# EAGLE design heaters (EAGLE 8.3.0)

## Sheet 1 of 4
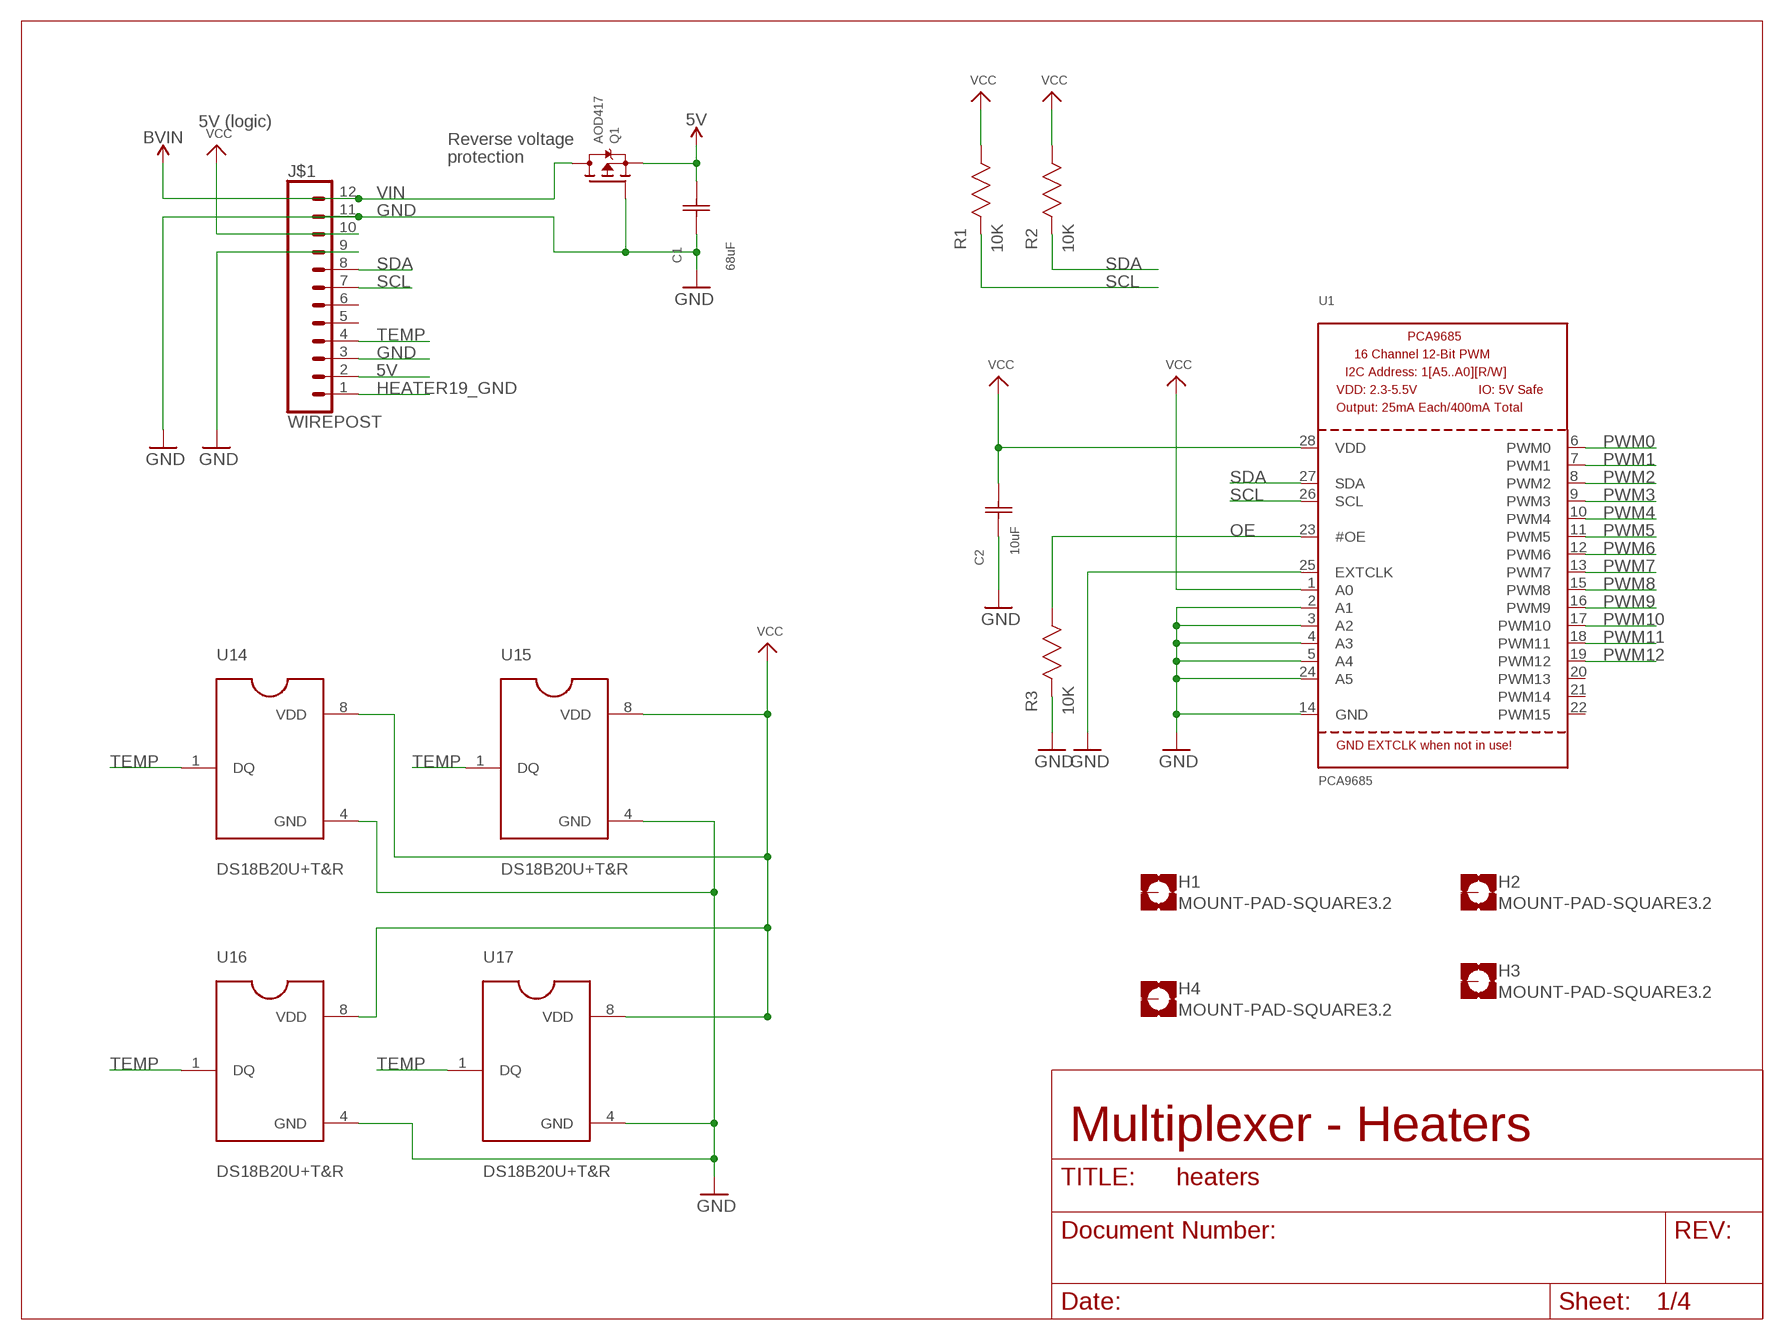
[diagram p0: schematic, sheet 1]

### Parts
C1  68uF  C5750X5R1A686M230KA  [CAP_5750]
C2  10uF  1206YC106KAT2A  [1206]
H1  MOUNT-PAD-SQUARE3.2  [3,2-PAD-SQUARE]
H2  MOUNT-PAD-SQUARE3.2  [3,2-PAD-SQUARE]
H3  MOUNT-PAD-SQUARE3.2  [3,2-PAD-SQUARE]
H4  MOUNT-PAD-SQUARE3.2  [3,2-PAD-SQUARE]
J$1  WIREPOST  [WIREWRAPPOST]
Q1  AOD417  MOSFET-PTO252  [TO252]
R1  10K  RC0603JR-0710KL  [RC0603N]
R2  10K  RC0603JR-0710KL  [RC0603N]
R3  10K  RC0603JR-0710KL  [RC0603N]
U1  PCA9685  [TSSOP28]
U14  DS18B20U+T&R  [SOP65P500X110-8N]
U15  DS18B20U+T&R  [SOP65P500X110-8N]
U16  DS18B20U+T&R  [SOP65P500X110-8N]
U17  DS18B20U+T&R  [SOP65P500X110-8N]

### Nets
5V: C1.2 J$1.2 Q1.2(S) ; also sheet 2,3,4
GND: C1.1 C2.1 J$1.3 J$1.9 J$1.11 Q1.1(G) R3.2 U1.2(A1) U1.3(A2) U1.4(A3) U1.5(A4) U1.14(GND) U1.24(A5) U1.25(EXTCLK) U14.4(GND) U15.4(GND) U16.4(GND) U17.4(GND) ; also sheet 2,3,4
HEATER19_GND: J$1.1
OE: R3.1 U1.23(#OE) ; also sheet 4
PWM0: U1.6(PWM0) ; also sheet 2
PWM1: U1.7(PWM1) ; also sheet 2
PWM2: U1.8(PWM2) ; also sheet 2
PWM3: U1.9(PWM3) ; also sheet 2
PWM4: U1.10(PWM4) ; also sheet 2
PWM5: U1.11(PWM5) ; also sheet 2
PWM6: U1.12(PWM6) ; also sheet 3
PWM7: U1.13(PWM7) ; also sheet 3
PWM8: U1.15(PWM8) ; also sheet 3
PWM9: U1.16(PWM9) ; also sheet 3
PWM10: U1.17(PWM10) ; also sheet 3
PWM11: U1.18(PWM11) ; also sheet 3
PWM12: U1.19(PWM12)
SCL: J$1.7 R1.2 U1.26(SCL) ; also sheet 4
SDA: J$1.8 R2.2 U1.27(SDA) ; also sheet 4
TEMP: J$1.4 U14.1(DQ) U15.1(DQ) U16.1(DQ) U17.1(DQ)
VCC: C2.2 J$1.10 R1.1 R2.1 U1.1(A0) U1.28(VDD) U14.8(VDD) U15.8(VDD) U16.8(VDD) U17.8(VDD) ; also sheet 4
VIN: J$1.12 Q1.3(D)
Unconnected: H1.B3,2(MOUNT) H2.B3,2(MOUNT) H3.B3,2(MOUNT) H4.B3,2(MOUNT) J$1.5 J$1.6 U1.20(PWM13) U1.21(PWM14) U1.22(PWM15)

### Notes on the sheet
- 5V (logic)
- Reverse voltage
- protection
- Multiplexer - Heaters

## Sheet 2 of 4
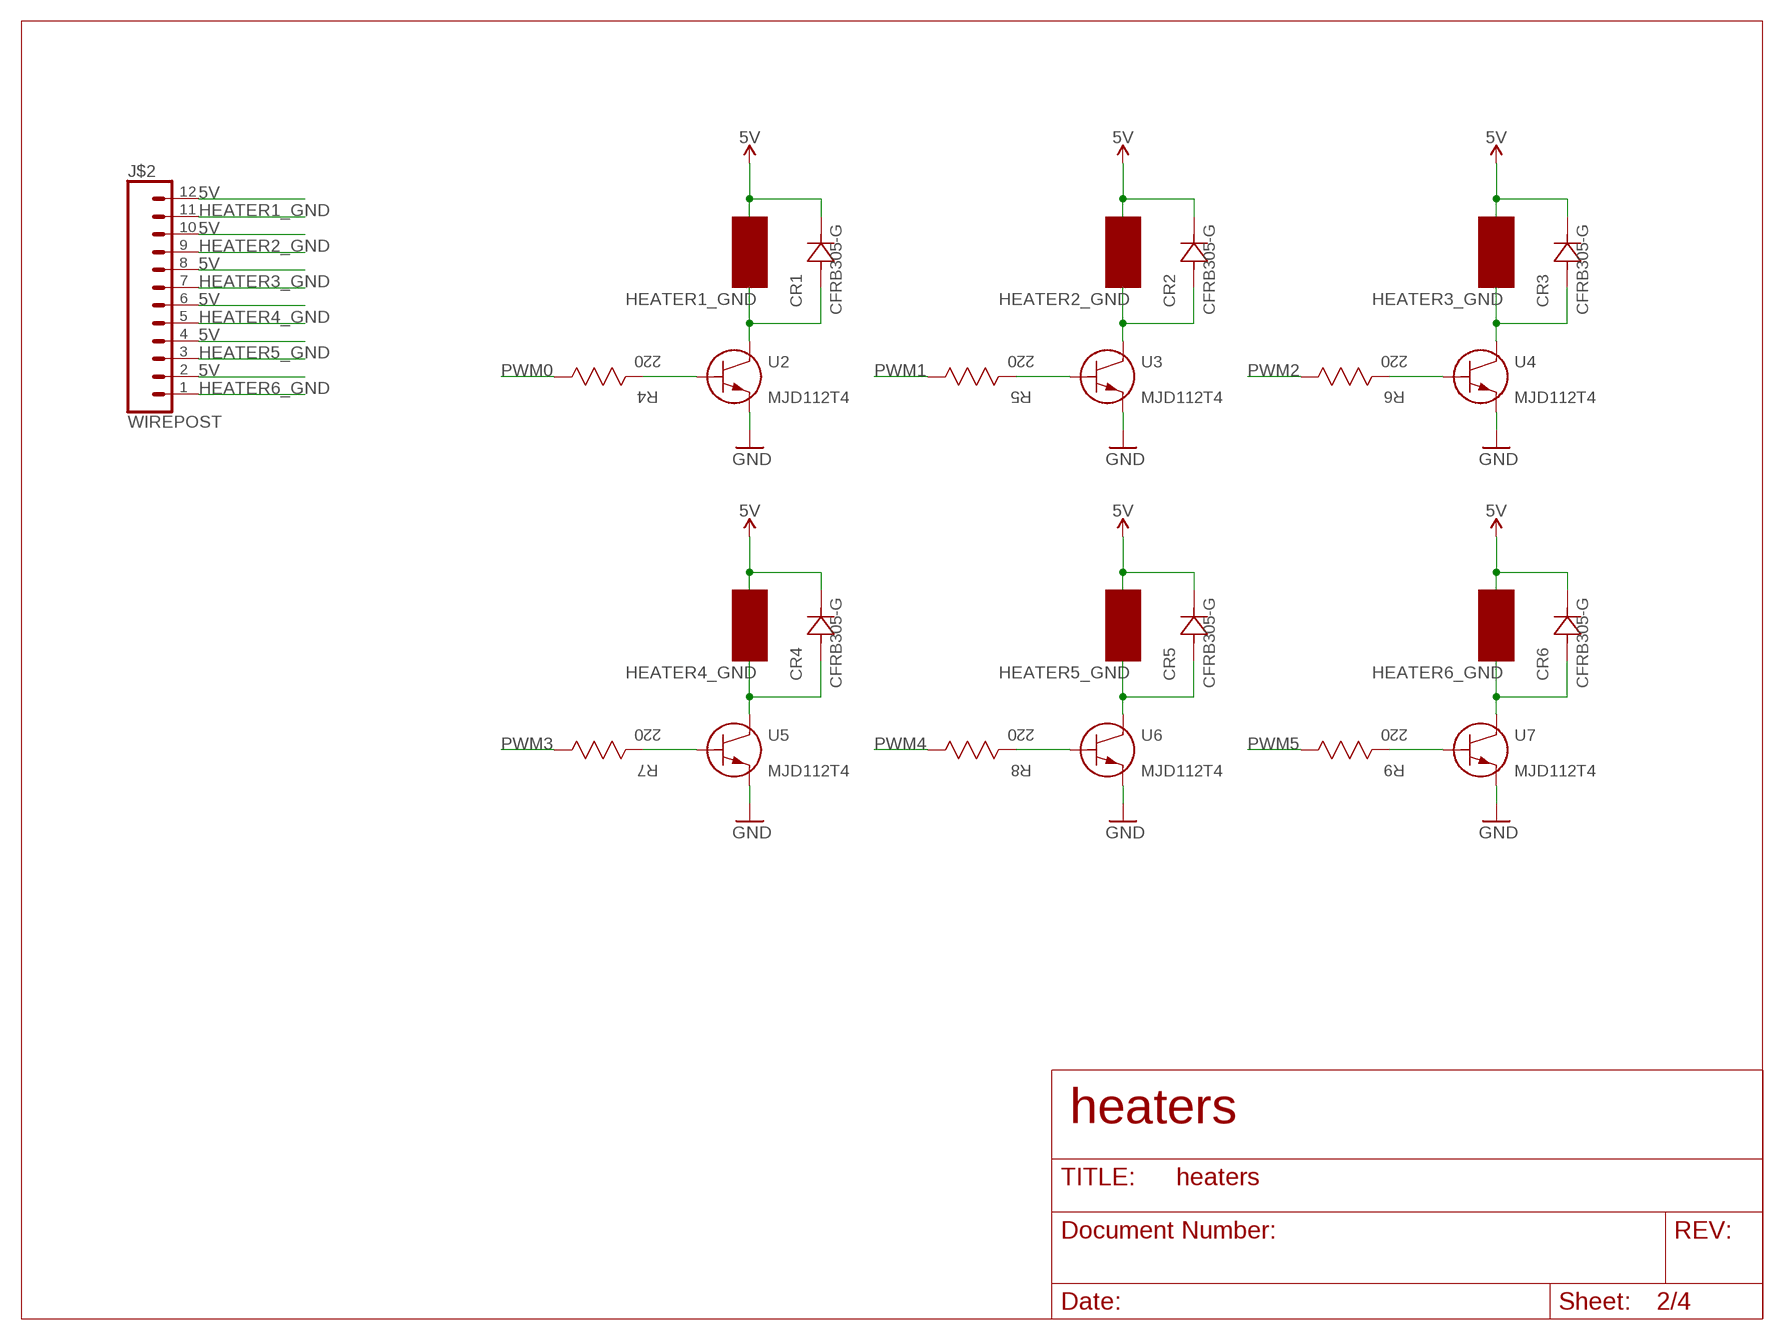
[diagram p1: schematic, sheet 2]

### Parts
CR1  CFRB305-G  [CFRB-G]
CR2  CFRB305-G  [CFRB-G]
CR3  CFRB305-G  [CFRB-G]
CR4  CFRB305-G  [CFRB-G]
CR5  CFRB305-G  [CFRB-G]
CR6  CFRB305-G  [CFRB-G]
J$2  WIREPOST  [WIREWRAPPOST]
R4  220  RC0603JR-07220RL  [RC0603N]
R5  220  RC0603JR-07220RL  [RC0603N]
R6  220  RC0603JR-07220RL  [RC0603N]
R7  220  RC0603JR-07220RL  [RC0603N]
R8  220  RC0603JR-07220RL  [RC0603N]
R9  220  RC0603JR-07220RL  [RC0603N]
U2  MJD112T4  [DPAK]
U3  MJD112T4  [DPAK]
U4  MJD112T4  [DPAK]
U5  MJD112T4  [DPAK]
U6  MJD112T4  [DPAK]
U7  MJD112T4  [DPAK]

### Nets
5V: CR1.1 CR2.1 CR3.1 CR4.1 CR5.1 CR6.1 J$2.2 J$2.4 J$2.6 J$2.8 J$2.10 J$2.12 ; also sheet 1,3,4
GND: U2.2(E2) U3.2(E2) U4.2(E2) U5.2(E2) U6.2(E2) U7.2(E2) ; also sheet 1,3,4
HEATER1_GND: CR1.2 J$2.11 U2.3(C3)
HEATER2_GND: CR2.2 J$2.9 U3.3(C3)
HEATER3_GND: CR3.2 J$2.7 U4.3(C3)
HEATER4_GND: CR4.2 J$2.5 U5.3(C3)
HEATER5_GND: CR5.2 J$2.3 U6.3(C3)
HEATER6_GND: CR6.2 J$2.1 U7.3(C3)
N$1: R5.2 U3.1(B1)
N$2: R6.2 U4.1(B1)
N$3: R7.2 U5.1(B1)
N$4: R8.2 U6.1(B1)
N$5: R9.2 U7.1(B1)
N$18: R4.2 U2.1(B1)
PWM0: R4.1 ; also sheet 1
PWM1: R5.1 ; also sheet 1
PWM2: R6.1 ; also sheet 1
PWM3: R7.1 ; also sheet 1
PWM4: R8.1 ; also sheet 1
PWM5: R9.1 ; also sheet 1

### Notes on the sheet
- HEATER | HEATER | HEATER
- HEATER | HEATER | HEATER
- heaters

## Sheet 3 of 4
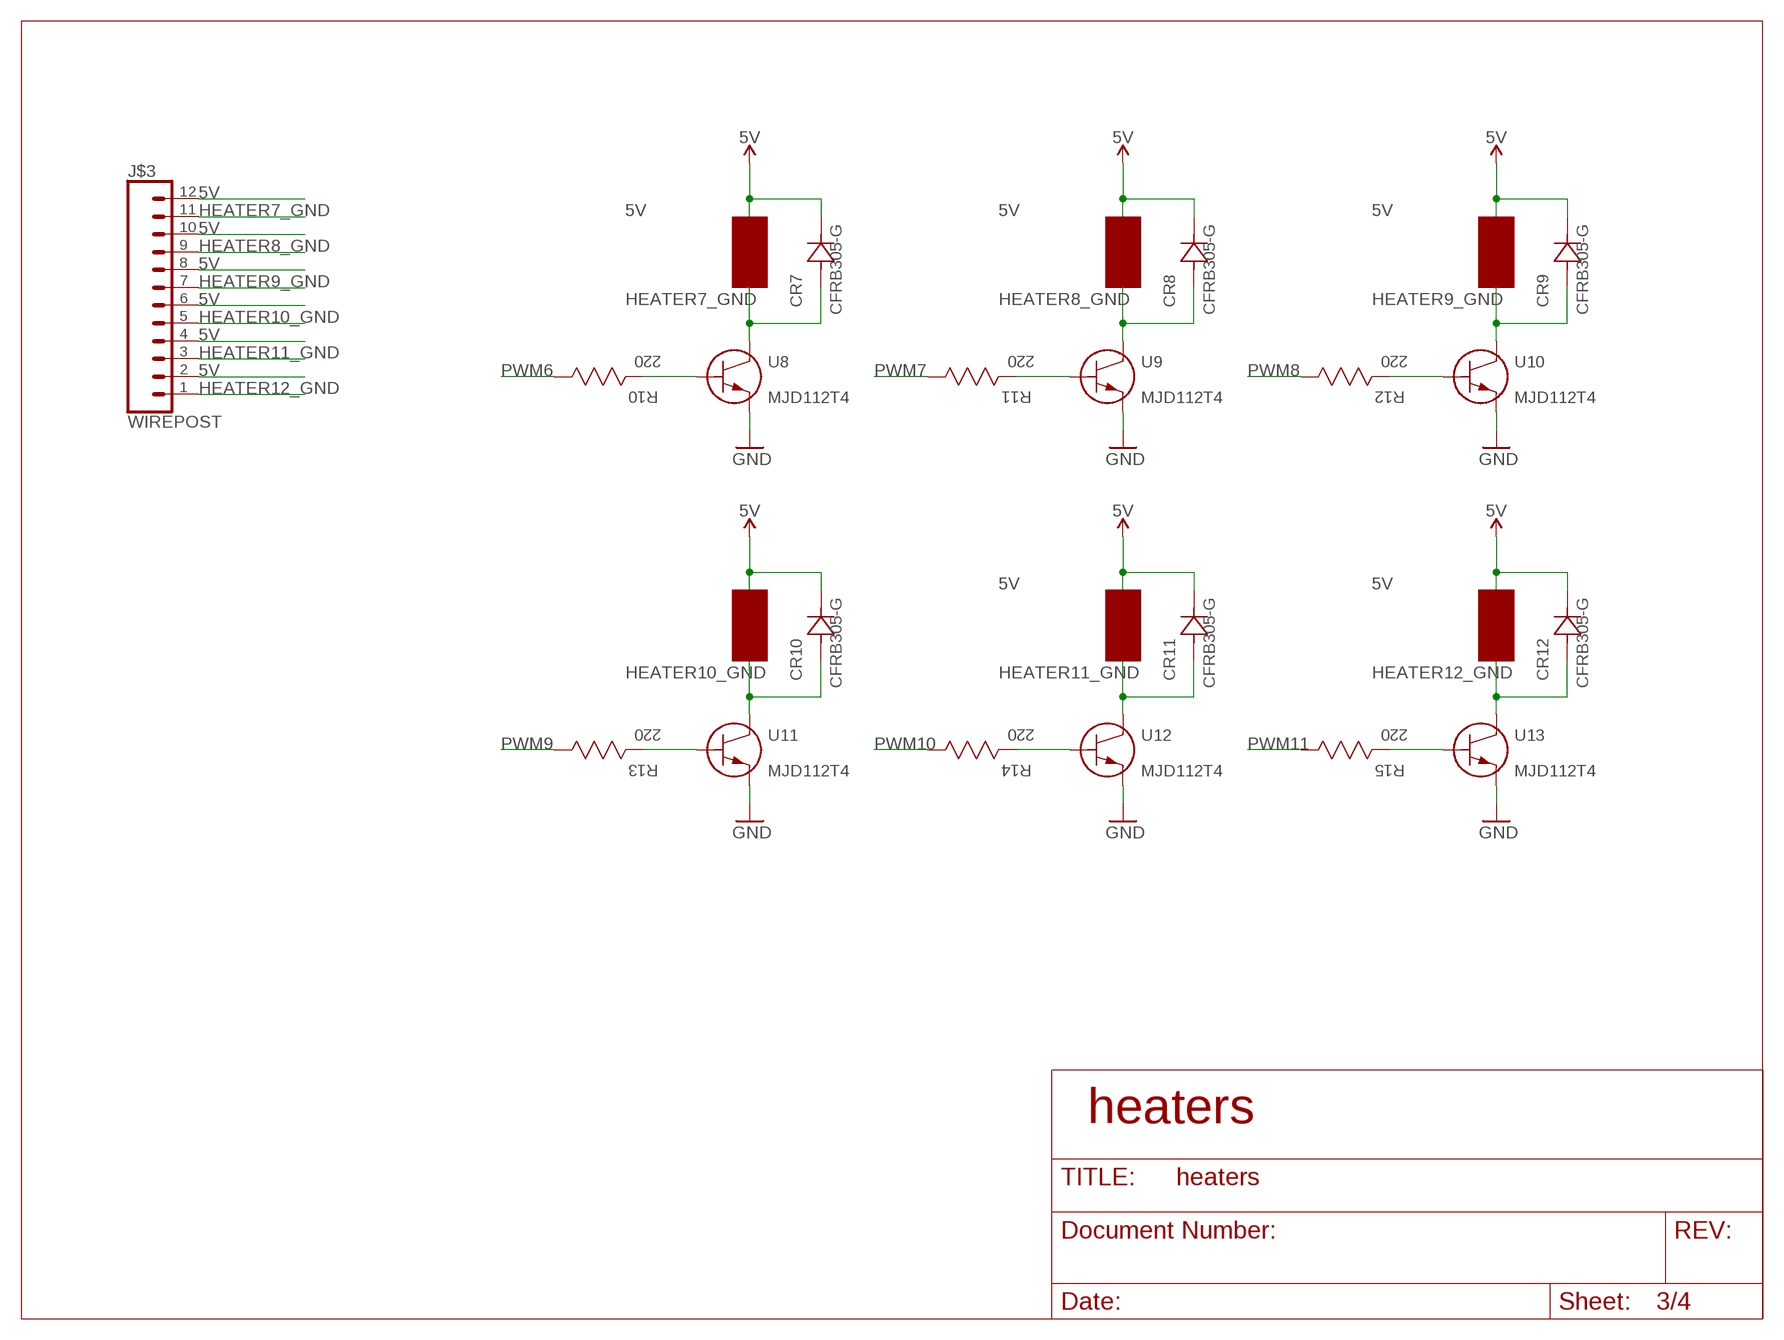
[diagram p2: schematic, sheet 3]

### Parts
CR7  CFRB305-G  [CFRB-G]
CR8  CFRB305-G  [CFRB-G]
CR9  CFRB305-G  [CFRB-G]
CR10  CFRB305-G  [CFRB-G]
CR11  CFRB305-G  [CFRB-G]
CR12  CFRB305-G  [CFRB-G]
J$3  WIREPOST  [WIREWRAPPOST]
R10  220  RC0603JR-07220RL  [RC0603N]
R11  220  RC0603JR-07220RL  [RC0603N]
R12  220  RC0603JR-07220RL  [RC0603N]
R13  220  RC0603JR-07220RL  [RC0603N]
R14  220  RC0603JR-07220RL  [RC0603N]
R15  220  RC0603JR-07220RL  [RC0603N]
U8  MJD112T4  [DPAK]
U9  MJD112T4  [DPAK]
U10  MJD112T4  [DPAK]
U11  MJD112T4  [DPAK]
U12  MJD112T4  [DPAK]
U13  MJD112T4  [DPAK]

### Nets
5V: CR7.1 CR8.1 CR9.1 CR10.1 CR11.1 CR12.1 J$3.2 J$3.4 J$3.6 J$3.8 J$3.10 J$3.12 ; also sheet 1,2,4
GND: U8.2(E2) U9.2(E2) U10.2(E2) U11.2(E2) U12.2(E2) U13.2(E2) ; also sheet 1,2,4
HEATER7_GND: CR7.2 J$3.11 U8.3(C3)
HEATER8_GND: CR8.2 J$3.9 U9.3(C3)
HEATER9_GND: CR9.2 J$3.7 U10.3(C3)
HEATER10_GND: CR10.2 J$3.5 U11.3(C3)
HEATER11_GND: CR11.2 J$3.3 U12.3(C3)
HEATER12_GND: CR12.2 J$3.1 U13.3(C3)
N$6: R10.2 U8.1(B1)
N$7: R11.2 U9.1(B1)
N$8: R12.2 U10.1(B1)
N$9: R13.2 U11.1(B1)
N$10: R14.2 U12.1(B1)
N$11: R15.2 U13.1(B1)
PWM6: R10.1 ; also sheet 1
PWM7: R11.1 ; also sheet 1
PWM8: R12.1 ; also sheet 1
PWM9: R13.1 ; also sheet 1
PWM10: R14.1 ; also sheet 1
PWM11: R15.1 ; also sheet 1

### Notes on the sheet
- HEATER | HEATER | HEATER
- HEATER | HEATER | HEATER
- heaters

## Sheet 4 of 4
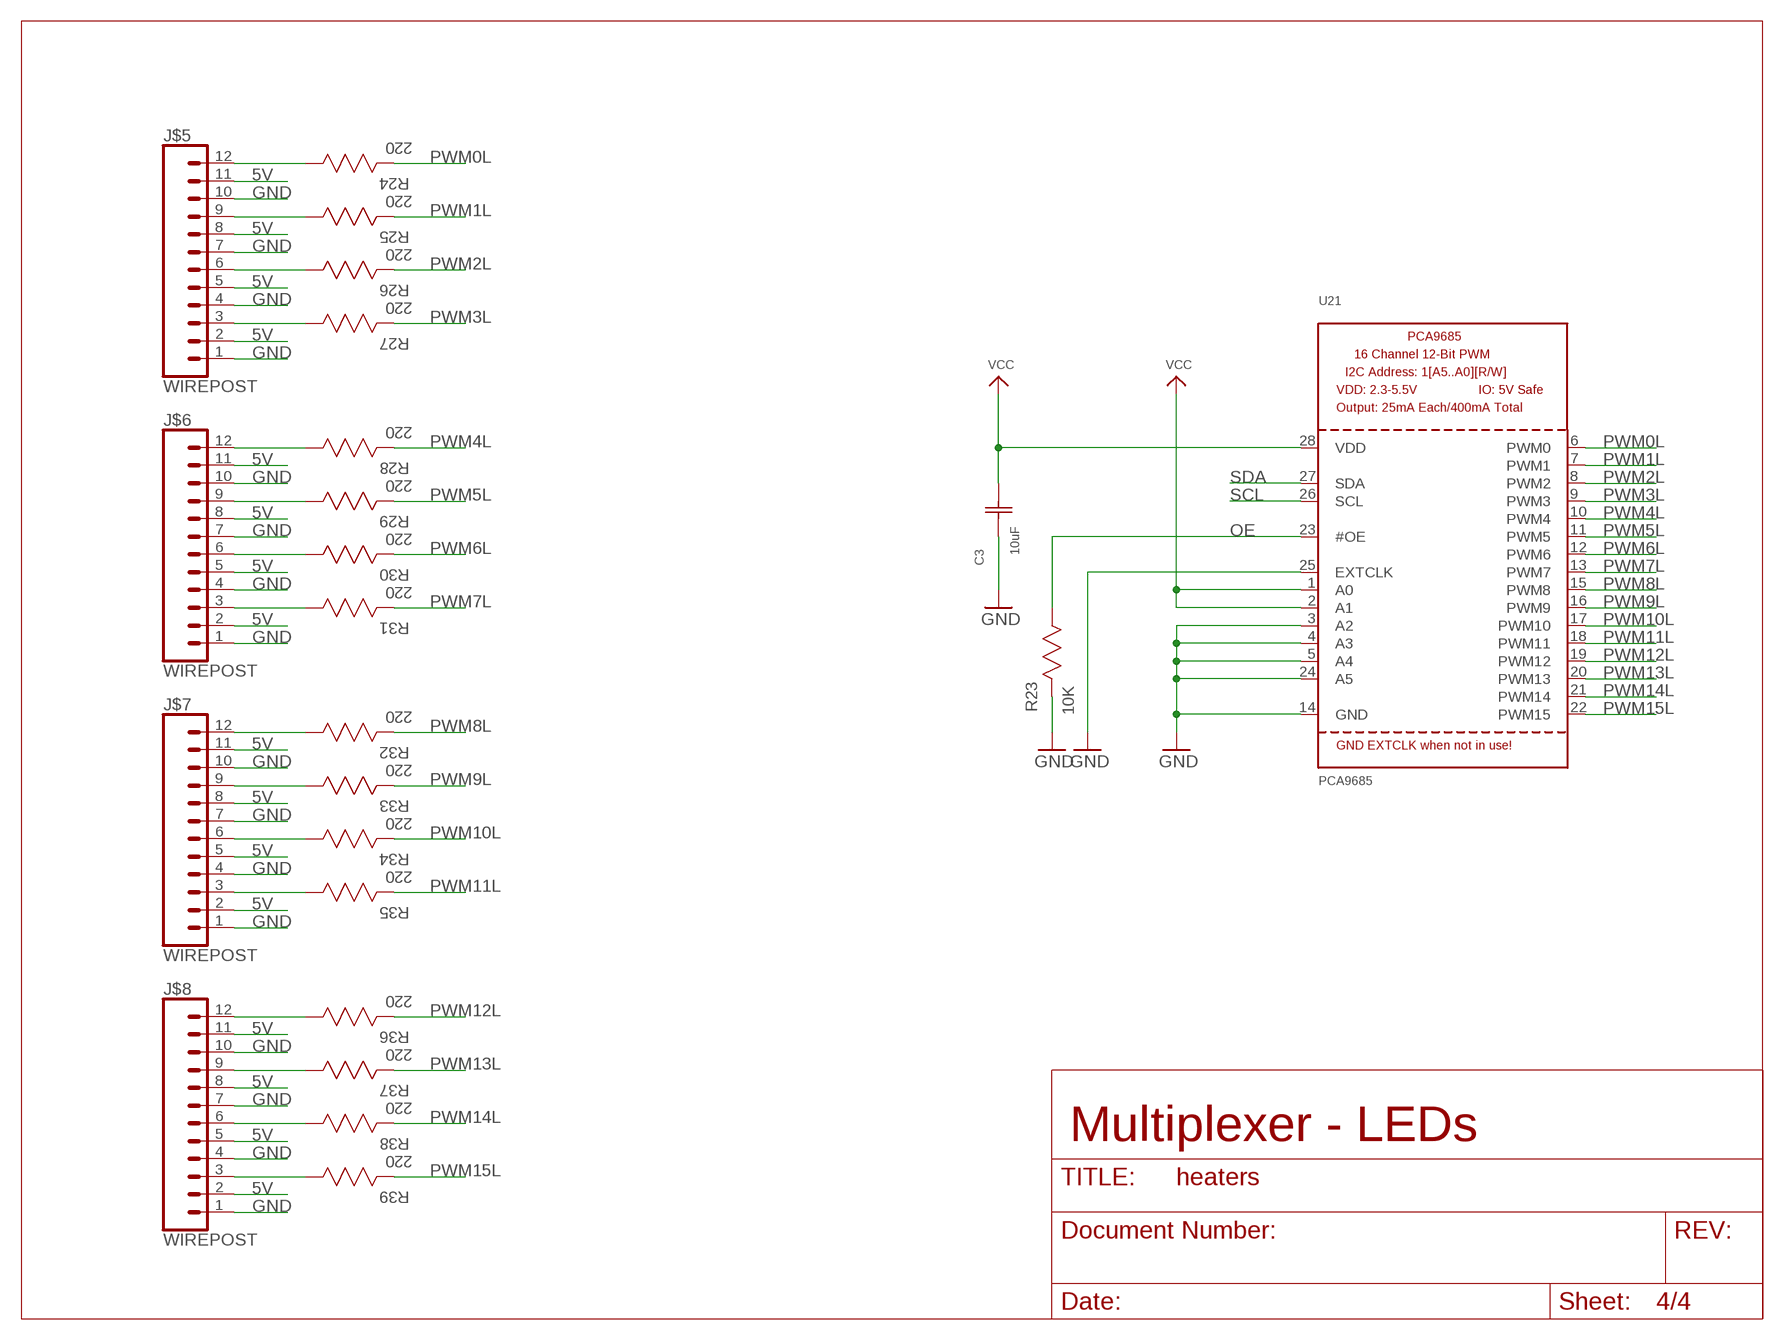
[diagram p3: schematic, sheet 4]

### Parts
C3  10uF  1206YC106KAT2A  [1206]
J$5  WIREPOST  [WIREWRAPPOST]
J$6  WIREPOST  [WIREWRAPPOST]
J$7  WIREPOST  [WIREWRAPPOST]
J$8  WIREPOST  [WIREWRAPPOST]
R23  10K  RC0603JR-0710KL  [RC0603N]
R24  220  RC0603JR-07220RL  [RC0603N]
R25  220  RC0603JR-07220RL  [RC0603N]
R26  220  RC0603JR-07220RL  [RC0603N]
R27  220  RC0603JR-07220RL  [RC0603N]
R28  220  RC0603JR-07220RL  [RC0603N]
R29  220  RC0603JR-07220RL  [RC0603N]
R30  220  RC0603JR-07220RL  [RC0603N]
R31  220  RC0603JR-07220RL  [RC0603N]
R32  220  RC0603JR-07220RL  [RC0603N]
R33  220  RC0603JR-07220RL  [RC0603N]
R34  220  RC0603JR-07220RL  [RC0603N]
R35  220  RC0603JR-07220RL  [RC0603N]
R36  220  RC0603JR-07220RL  [RC0603N]
R37  220  RC0603JR-07220RL  [RC0603N]
R38  220  RC0603JR-07220RL  [RC0603N]
R39  220  RC0603JR-07220RL  [RC0603N]
U21  PCA9685  [TSSOP28]

### Nets
5V: J$5.2 J$5.5 J$5.8 J$5.11 J$6.2 J$6.5 J$6.8 J$6.11 J$7.2 J$7.5 J$7.8 J$7.11 J$8.2 J$8.5 J$8.8 J$8.11 ; also sheet 1,2,3
GND: C3.1 J$5.1 J$5.4 J$5.7 J$5.10 J$6.1 J$6.4 J$6.7 J$6.10 J$7.1 J$7.4 J$7.7 J$7.10 J$8.1 J$8.4 J$8.7 J$8.10 R23.2 U21.3(A2) U21.4(A3) U21.5(A4) U21.14(GND) U21.24(A5) U21.25(EXTCLK) ; also sheet 1,2,3
N$20: J$5.12 R24.1
N$21: J$5.9 R25.1
N$22: J$5.6 R26.1
N$23: J$5.3 R27.1
N$24: J$6.12 R28.1
N$25: J$6.9 R29.1
N$26: J$6.6 R30.1
N$27: J$6.3 R31.1
N$28: J$7.12 R32.1
N$29: J$7.9 R33.1
N$30: J$7.6 R34.1
N$31: J$7.3 R35.1
N$32: J$8.12 R36.1
N$33: J$8.9 R37.1
N$34: J$8.6 R38.1
N$35: J$8.3 R39.1
OE: R23.1 U21.23(#OE) ; also sheet 1
PWM0L: R24.2 U21.6(PWM0)
PWM1L: R25.2 U21.7(PWM1)
PWM2L: R26.2 U21.8(PWM2)
PWM3L: R27.2 U21.9(PWM3)
PWM4L: R28.2 U21.10(PWM4)
PWM5L: R29.2 U21.11(PWM5)
PWM6L: R30.2 U21.12(PWM6)
PWM7L: R31.2 U21.13(PWM7)
PWM8L: R32.2 U21.15(PWM8)
PWM9L: R33.2 U21.16(PWM9)
PWM10L: R34.2 U21.17(PWM10)
PWM11L: R35.2 U21.18(PWM11)
PWM12L: R36.2 U21.19(PWM12)
PWM13L: R37.2 U21.20(PWM13)
PWM14L: R38.2 U21.21(PWM14)
PWM15L: R39.2 U21.22(PWM15)
SCL: U21.26(SCL) ; also sheet 1
SDA: U21.27(SDA) ; also sheet 1
VCC: C3.2 U21.1(A0) U21.2(A1) U21.28(VDD) ; also sheet 1

### Notes on the sheet
- Multiplexer - LEDs

## Library data of the parts
C1 = capacitor68uf:C5750X5R1A686M230KA; MANUFACTURER_PART_NUMBER: C5750X5R1A686M230KA; VENDOR: TDK
C2 C3 = capacitor10uf:1206YC106KAT2A; MANUFACTURER_PART_NUMBER: 1206YC106KAT2A; VENDOR: AVX Corporation
CR1-CR12 = diode_rectifier3A:CFRB305-G; MANUFACTURER_PART_NUMBER: CFRB305G; VENDOR: Comchip
H1-H4 = holes:MOUNT-PAD-SQUARE: MOUNTING PAD, square
J$1-J$3 J$5-J$8 = cubesat:WIREPOST
Q1 = microbuilder:MOSFET-P: P-Channel Mosfet LEGEND VDS: Voltage Drain-Source ID: Drain Current RDS(ON): Drain-Source On-State Resistance VGS(TH): Gate-Source Threshold Voltage CISS: Drain-Source Input Capacitance SOT-23 Name VDS ID RDS(ON) VGS(TH) CISS Order Number IRLML5103 30V 760mA 600 mOhm -- 75pF @ 25V Digikey: IRLML5103PBFCT-ND IRLML6401 12V 4.3A 50 mOhm 950mV @ 250µA 830pF @ 10V Digikey: IRLML6401PBFTR-ND NTR0202PL 20V 400mA 800 mOhm 2.3V @ 250uA 70pF @ 5V Digikey: NTR0202PLT1GOSTR-ND NTR4101PT1G 20V 1.8A 85 mOhm 1.2V @ 250uA 675pF @ 10V Digikey: NTR4101PT1GOSCT-ND DMP2004K 20V 600mA 900 mOhm 1V @ 250uA 175pF @ 16V Digikey: DMP2004KDICT-ND PMV65XP 20V 3.9A 76 mOhm 950mV @ 1mA 725pF @ 20V Digikey: 568-2358-2-ND TO-252 Name VDS ID RDS(ON) VGS(TH) CISS Order Number AOD417 30V 25A 34 mOhm 3V @ 250µA 920pF @ 15V Digikey: 785-1106-2-ND
R1-R3 R23 = cubesat_r10K:RC0603JR-0710KL; MANUFACTURER_PART_NUMBER: RC0603JR0710KL; VENDOR: Yageo
R4-R15 R24-R39 = cubesat_r220:RC0603JR-07220RL; MANUFACTURER_PART_NUMBER: RC0603JR07220RL; VENDOR: Yageo
U1 U21 = microbuilder:PCA9685: PCA9685 - 16 Channel 12-Bit I2C PWM Controller 5.0V tolerant 16 channel, 12-bit I2C PWM controller with 25mA per output (max. 400mA total) Digikey: 568-5931-1-ND
U2-U13 = mjd1124:MJD112T4; MANUFACTURER_PART_NUMBER: MJD112T4; VENDOR: ST Microelectronics
U14-U17 = cubesat_:DS18B20U+T&R: Programmable Resolution 1-Wire Digital Thermometer; AVAILABILITY: Good; DESCRIPTION: Temp Sensor Digital Serial (1-Wire) 8-Pin uMAX T/R; MF: Maxim Integrated; MP: DS18B20U+T&amp;R; PACKAGE: MSOP-8 Maxim Integrated; PRICE: 2.79 USD

## Net classes
1 power: width 0.61 mm, drill 0.406 mm, clearance 0.205 mm to class 0, clearance 0.205 mm
2 gnd: width 0.305 mm, drill 0.406 mm, clearance 0.205 mm to class 0, clearance 0.205 mm to class 1, clearance 0.205 mm

## Board
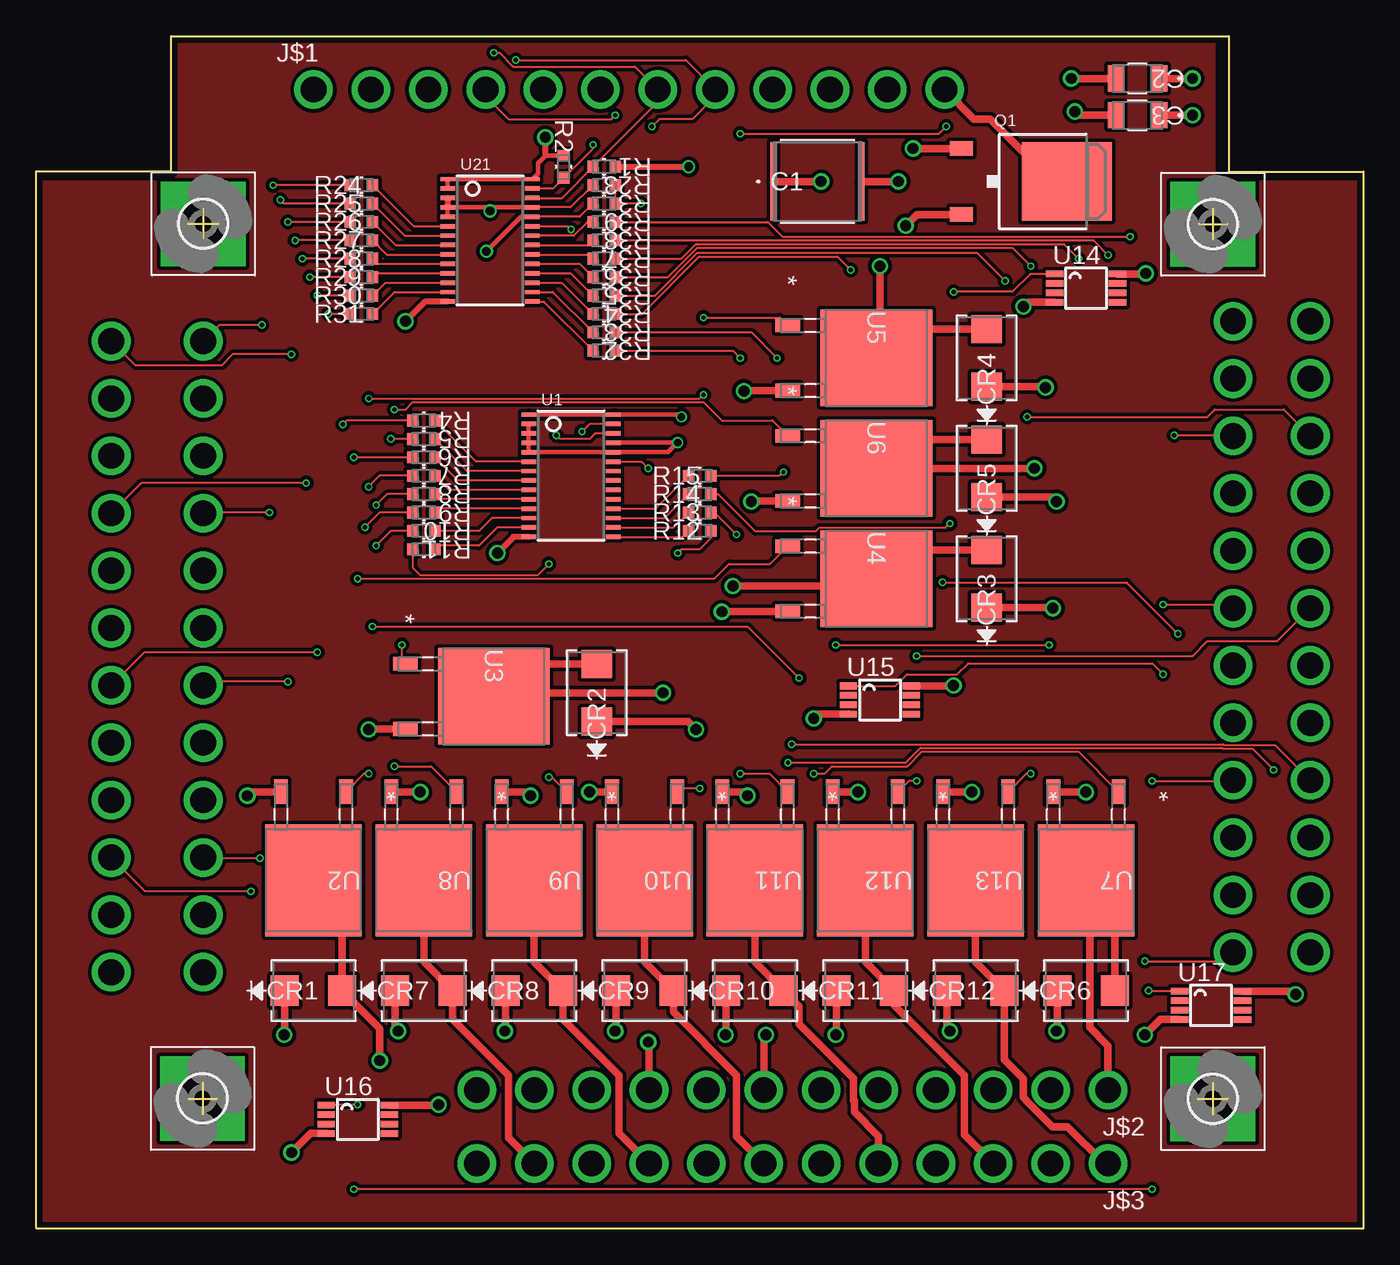
[diagram p4: board, top side]
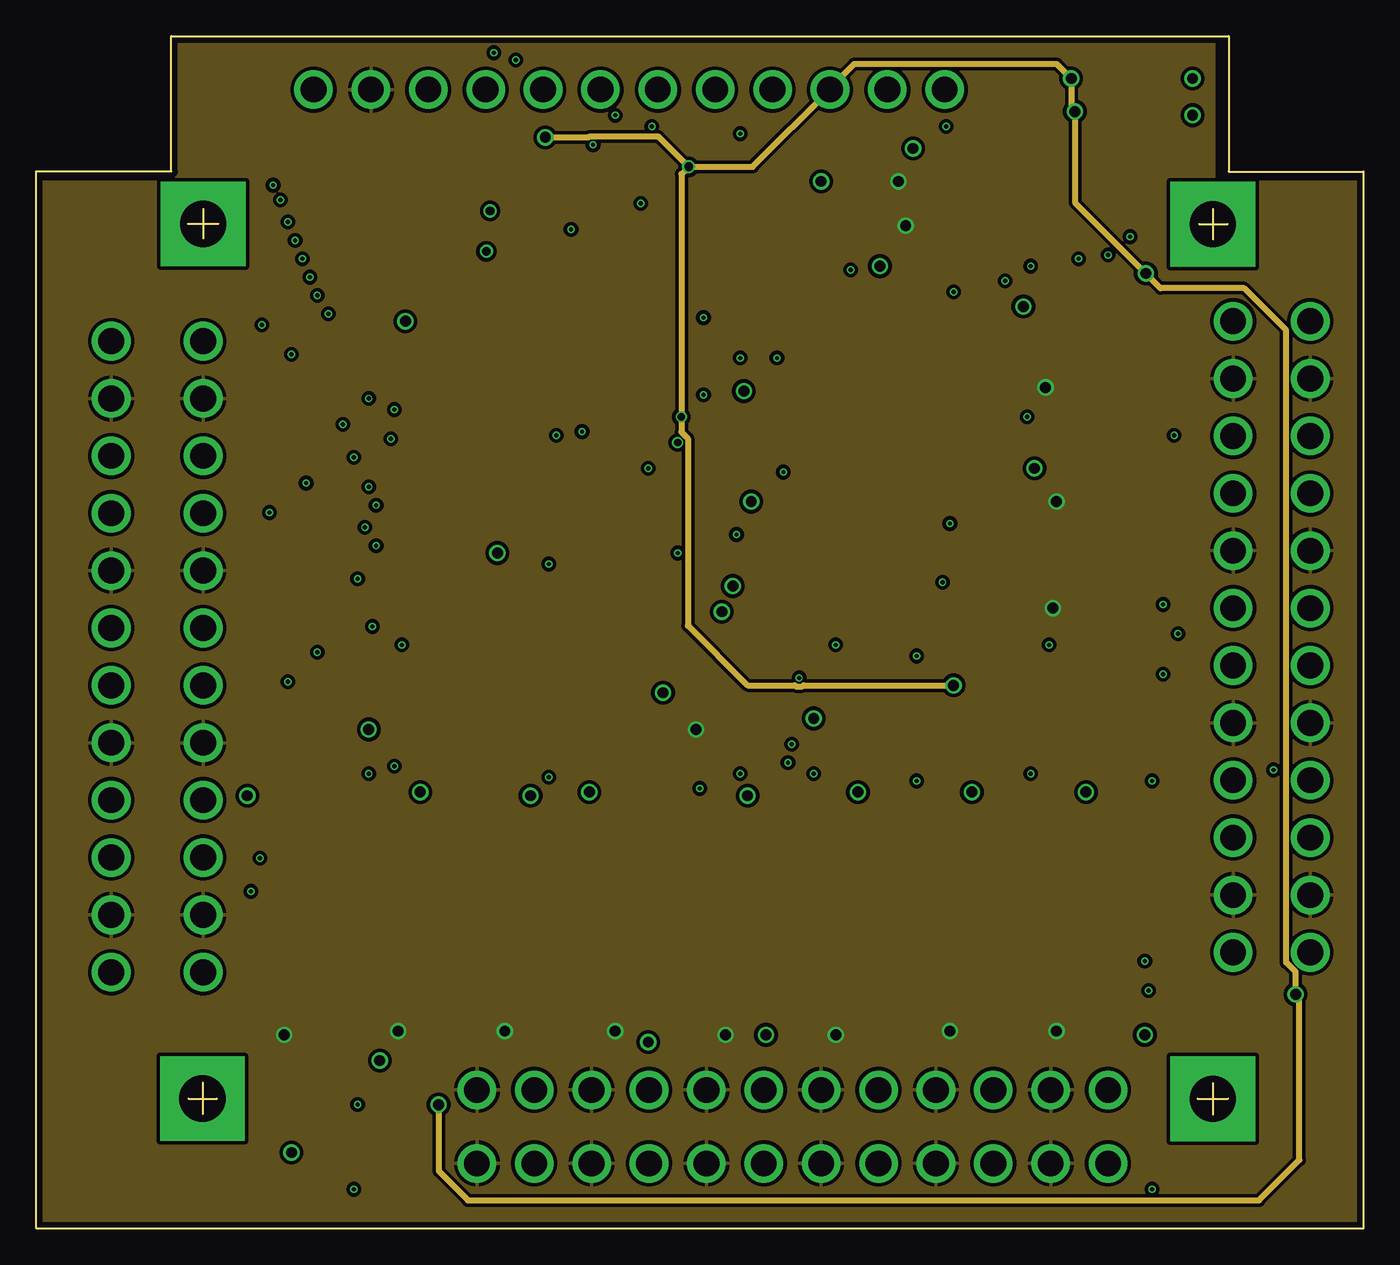
[diagram p5: board, inner layer Route2]
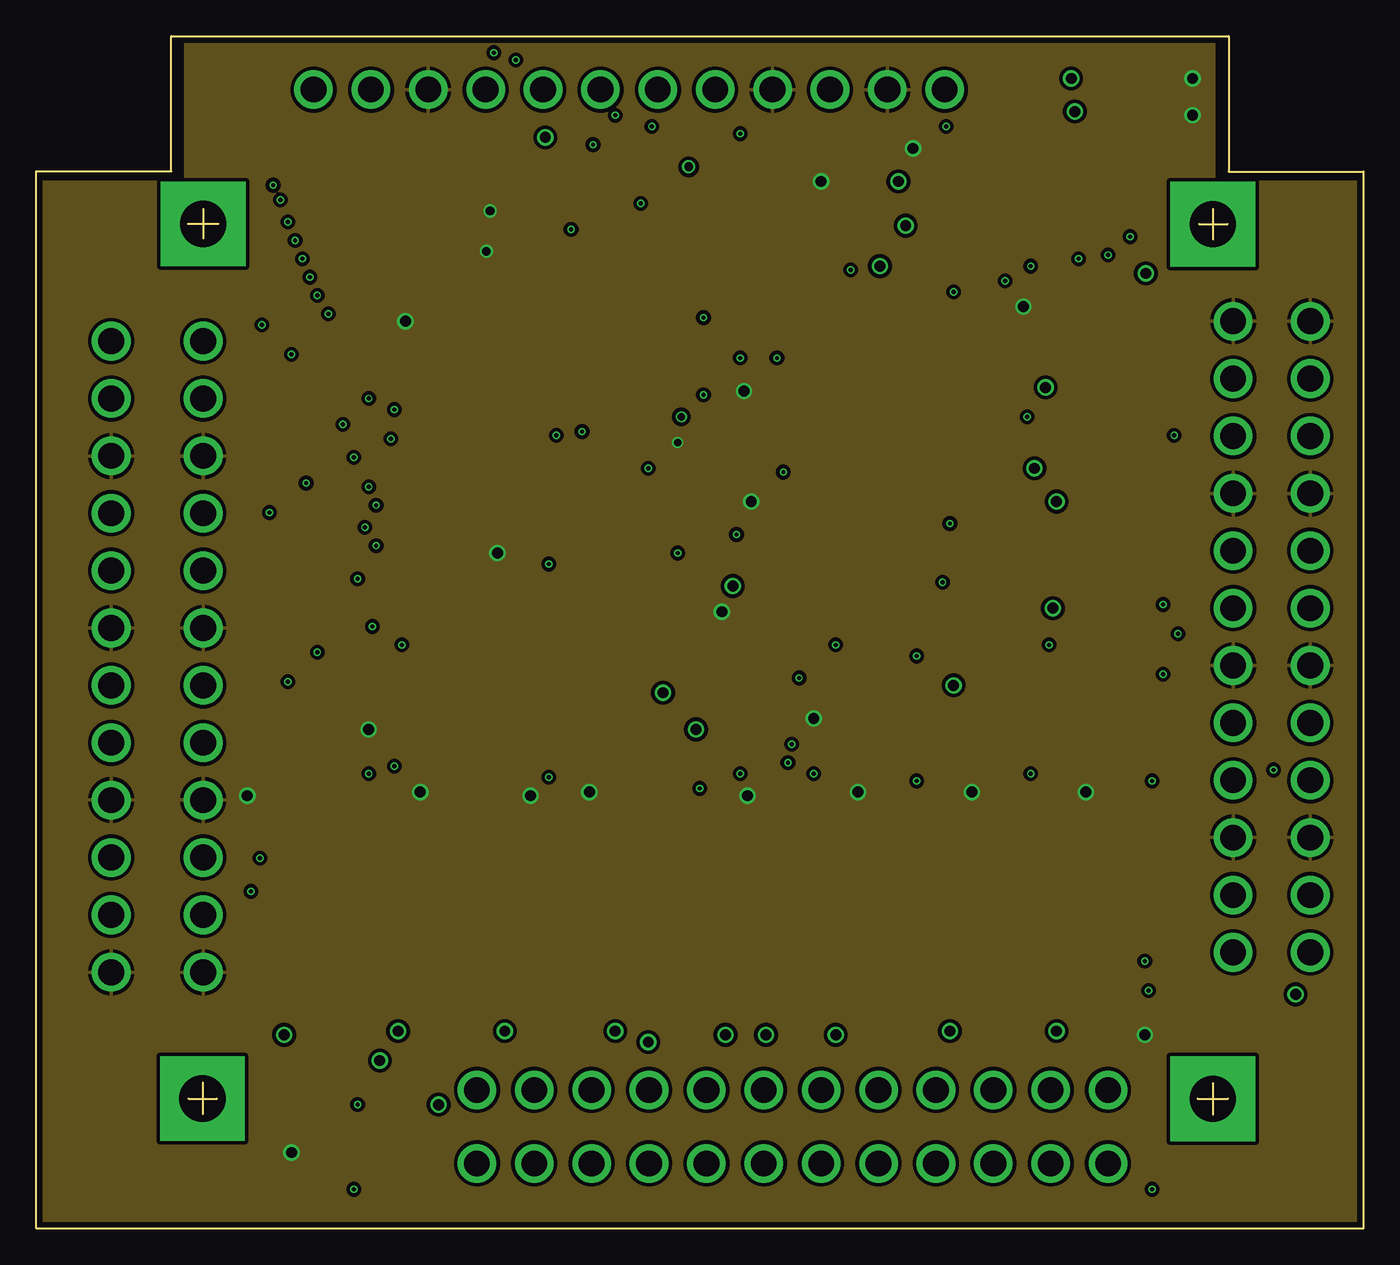
[diagram p6: board, inner layer Route15]
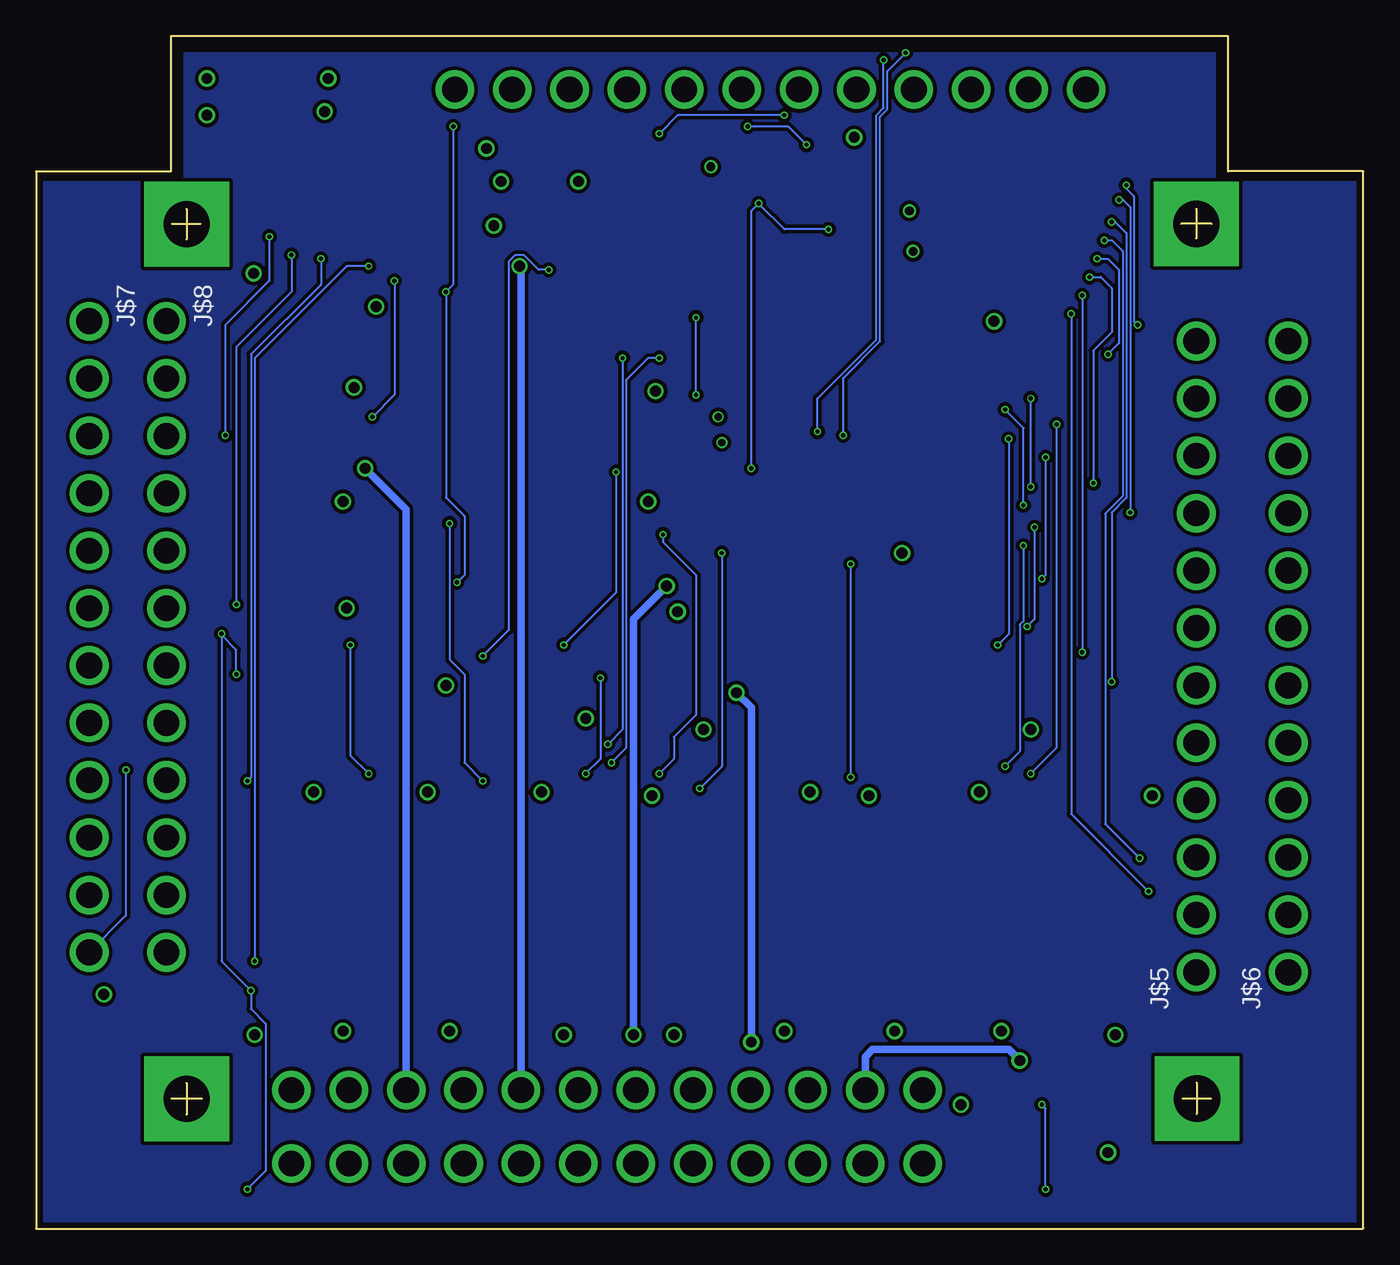
[diagram p7: board, bottom side, seen from below]

Size 91.64 x 82.35 mm. Coordinates in mm from the lower left corner, seen from the top.
Outline: 11.53,70.43 11.53,68.38
Outline: 10.49,69.39 12.6,69.39
Outline: 10.52,8.97 12.5,8.97
Outline: 11.51,10.08 11.51,7.92
Outline: 81.25,10.06 81.25,7.87
Outline: 80.19,8.97 82.3,8.97
Outline: 81.25,70.41 81.25,68.33
Outline: 80.29,69.37 82.27,69.37
Outline: 0,0.03 0,73.02 9.32,73.02 9.32,82.35 82.35,82.35 82.35,73 91.64,73 91.64,0 0.03,0 0,0.03
Copper layers (1*2*15*16): Top 0.035559375mm / dielectric 0.17018125mm / Route2 0.01778125mm / dielectric 47mil / Route15 0.01778125mm / dielectric 0.17018125mm / Bottom 0.035559375mm
Design rules "oshpark-4layer": minimum track width 5mil, minimum drill 10mil, track to track 5mil, track to pad 5mil, pad to pad 5mil, via to via 5mil, smd to smd 5mil, copper to edge 15mil, drill to drill 6mil, minimum pad ring 4mil, minimum via ring 4mil, stop-mask expansion 2.5mil, vias tented up to drill 0mil, thermal gap 10mil

### Footprints (pad centres in the part's own frame; a part is rotated, then mirrored left to right if it is on the bottom)
CAP_5750 = smd 0.406 x 5.41: 1 -3.048,0; 2 3.048,0
1206 = smd 1.118 x 1.803: 1 -1.499,0; 2 1.499,0
CFRB-G = smd 1.93 x 2.108: 1 -1.981,0; 2 1.981,0
3,2-PAD-SQUARE = drill 3.2 pad 5.842 square: B3,2 0,0
WIREWRAPPOST = drill 1.778 pad 2.54: 1 0,0; 2 3.962,0; 3 7.925,0; 4 11.887,0; 5 15.85,0; 6 19.812,0; 7 23.774,0; 8 27.737,0; 9 31.699,0; 10 35.662,0; 11 39.624,0; 12 43.586,0
TO252 = smd 1 x 1.6: 1 -2.28,-4.8; 2 2.28,-4.8 | smd 5.4 x 6.2: 3 0,2.5
RC0603N = smd 0.762 x 0.813: 1 -0.775,0; 2 0.775,0
TSSOP28 = smd 0.305 x 0.991: 1 -4.225,-2.918; 2 -3.575,-2.918; 3 -2.925,-2.918; 4 -2.275,-2.918; 5 -1.625,-2.918; 6 -0.975,-2.918; 7 -0.325,-2.918; 8 0.325,-2.918; 9 0.975,-2.918; 10 1.625,-2.918; 11 2.275,-2.918; 12 2.925,-2.918; 13 3.575,-2.918; 14 4.225,-2.918; 15 4.225,2.918; 16 3.575,2.918; 17 2.925,2.918; 18 2.275,2.918; 19 1.625,2.918; 20 0.975,2.918; 21 0.325,2.918; 22 -0.325,2.918; 23 -0.975,2.918; 24 -1.625,2.918; 25 -2.275,2.918; 26 -2.925,2.918; 27 -3.575,2.918; 28 -4.225,2.918
DPAK = smd 0.94 x 1.702: 1 -2.25,-6.109; 2 2.25,-6.109 | smd 6.655 x 7.722: 3 0,0
SOP65P500X110-8N = smd 1.2 x 0.45: 1 -2.175,0.975; 2 -2.175,0.325; 3 -2.175,-0.325; 4 -2.175,-0.975; 5 2.175,-0.975; 6 2.175,-0.325; 7 2.175,0.325; 8 2.175,0.975

### Placement (x,y rotation side)
C1  53.95,72.31 0 top
C2  76.05,79.43 180 top
C3  76.05,76.89 180 top
CR1  19.15,16.43 0 top
CR2  38.71,37.01 90 top
CR3  65.63,44.88 90 top
CR4  65.63,60.12 90 top
CR5  65.63,52.5 90 top
CR6  72.49,16.43 0 top
CR7  26.77,16.43 0 top
CR8  34.39,16.43 0 top
CR9  42.01,16.43 0 top
CR10  49.63,16.43 0 top
CR11  57.25,16.43 0 top
CR12  64.87,16.43 0 top
H1  81.25,69.37 0 top
H2  11.48,8.99 0 top
H3  81.25,8.97 0 top
H4  11.53,69.39 0 top
J$1  19.15,78.66 0 top
J$2  74.02,9.58 180 top
J$3  74.02,4.5 180 top
J$5  11.53,17.7 90 bottom
J$6  5.18,17.7 90 bottom
J$7  87.99,62.66 270 bottom
J$8  82.65,62.66 270 bottom
Q1  68.68,72.31 270 top
R1  39.22,73.33 180 top
R2  36.42,73.33 270 top
R3  39.22,70.79 180 top
R4  26.77,55.8 180 top
R5  26.77,54.53 180 top
R6  26.77,53.26 180 top
R7  26.77,51.99 180 top
R8  26.77,50.72 180 top
R9  26.77,49.45 180 top
R10  26.77,48.18 180 top
R11  26.77,46.91 180 top
R12  45.82,48.18 0 top
R13  45.82,49.45 0 top
R14  45.82,50.72 0 top
R15  45.82,51.99 0 top
R23  39.22,72.06 180 top
R24  22.45,72.06 0 top
R25  22.45,70.79 0 top
R26  22.45,69.52 0 top
R27  22.45,68.25 0 top
R28  22.45,66.98 0 top
R29  22.45,65.71 0 top
R30  22.45,64.44 0 top
R31  22.45,63.17 0 top
R32  39.22,60.63 180 top
R33  39.22,61.9 180 top
R34  39.22,63.17 180 top
R35  39.22,64.44 180 top
R36  39.22,65.71 180 top
R37  39.22,66.98 180 top
R38  39.22,68.25 180 top
R39  39.22,69.52 180 top
U1  36.93,51.99 270 top
U2  19.15,24.05 180 top
U3  31.6,36.75 270 top
U4  58.01,44.88 270 top
U5  58.01,60.12 270 top
U6  58.01,52.5 270 top
U7  72.49,24.05 180 top
U8  26.77,24.05 180 top
U9  34.39,24.05 180 top
U10  42.01,24.05 180 top
U11  49.63,24.05 180 top
U12  57.25,24.05 180 top
U13  64.87,24.05 180 top
U14  72.49,64.95 0 top
U15  58.27,36.5 0 top
U16  22.2,7.54 0 top
U17  81.13,15.42 0 top
U21  31.34,68.25 270 top

### Tracks (layer width: path | path; a pad name or v marks a point on that pad's centre or on a via)
5V  (via drill 0.75)
  Top 0.508: C1.2 v59.54,72.31 | Q1.2 60.81,70.03 v60.05,69.27 | CR4.1 69.65,58.14 v69.7,58.09 | CR3.1 70.15,42.9 v70.21,42.85 | CR5.1 70.15,50.52 v70.46,50.22 | CR1.1 17.17,13.44 v17.12,13.39 | CR7.1 24.79,13.84 v24.99,13.64 | CR8.1 32.41,13.69 v32.36,13.64 | CR9.1 40.03,13.69 v39.98,13.64 | CR10.1 47.65,13.44 v47.6,13.39 | CR11.1 55.27,13.44 v55.22,13.39 | CR6.1 70.51,13.69 v70.46,13.64 | CR12.1 62.89,13.84 v63.09,13.64 | CR2.1 45.01,35.03 v45.57,34.47
  pour Route2 (isolate 0.254): 0.1,-0.08 91.54,-0.08 91.54,72.31 81.38,72.31 81.38,82.47 8.99,82.47 8.99,72.31 0.1,72.31
GND  (via drill 0.5, 0.6, 0.75)
  Top 0.127: U21.25 36.91,70.52 R23.2 | U21.24 37.53,69.87 R3.2
  Top 0.305: U21.25 31.59,70.52 31.4,70.34 | 31.4,70.34 v31.34,70.28 | U21.24 33.48,69.87 v31.09,67.49 | U1.25 44.29,54.27 v44.3,54.28 43.64,53.62 U1.24 34.09,53.62 | 34.09,53.62 U1.5 | 31.4,70.34 31.22,70.52 U21.4 U21.5 | U1.2 U1.3 U1.4 34.01,53.7 34.09,53.62
  Top 0.406: U21.3 U21.4 | U21.14 26.86,64.02 v25.5,62.66 | U1.14 32.96,47.77 v31.85,46.66
  Top 0.508: C1.1 v54.2,72.31 | Q1.1 v60.56,74.59 v60.55,74.6 | C2.1 v79.86,79.43 | C3.1 v79.86,76.89 | U14.4 68.47,63.97 v68.17,63.68 | U16.4 18.94,6.57 v17.63,5.26 | U17.4 77.61,14.44 v76.56,13.39 | U15.4 53.99,35.52 v53.7,35.23 | U3.2 23,34.5 v22.96,34.47 | U8.2 26.5,30.16 v26.52,30.15 | U2.2 14.85,30.16 v14.58,29.9 | U9.2 33.87,30.16 v34.14,29.9 | U10.2 38.21,30.16 v38.2,30.15 | U11.2 48.86,30.16 v49.12,29.9 | U12.2 56.73,30.16 v56.74,30.15 | U13.2 64.6,30.16 v64.62,30.15 | U7.2 72.48,30.16 v72.49,30.15 | U4.2 47.38,42.63 v47.35,42.6 | U6.2 49.41,50.25 v49.38,50.22 | U5.2 48.91,57.87 v48.87,57.84
  pour Route15 (isolate 0.254): 0.1,-0.08 91.54,-0.08 91.54,72.31 81.38,72.31 81.38,82.47 10.26,82.47 10.26,72.31 0.1,72.31
HEATER1_GND  (via drill 0.75)
  Top 0.508: U2.3 21.13,22.07 CR1.2 23.72,13.84 v23.72,11.61
  Bottom 0.508: J$2.11 34.39,11.86 33.88,12.37 24.49,12.37 v23.72,11.61
HEATER2_GND  (via drill 0.75)
  Top 0.508: CR2.2 33.83,38.99 U3.3 31.34,36.5 31.09,36.5 31.6,37.01 v43.28,37.01 | J$2.9 42.32,12.83 v42.27,12.88
  Bottom 0.508: v42.27,12.88 42.27,35.99 v43.28,37.01
HEATER3_GND  (via drill 0.75)
  Top 0.508: CR3.2 59.99,46.86 58.37,45.24 | 58.37,45.24 U4.3 | J$2.7 50.24,13.23 v50.39,13.39 | v48.11,44.37 57.51,44.37 58.37,45.24
  Bottom 0.508: v50.39,13.39 50.39,42.09 v48.11,44.37
HEATER4_GND  (via drill 0.75)
  Top 0.508: CR4.2 59.99,62.1 58.11,60.21 | 58.11,60.21 U5.3 | v58.27,66.47 58.27,60.38 58.11,60.21
  Bottom 0.508: J$2.5 58.17,66.37 v58.27,66.47
HEATER5_GND  (via drill 0.75)
  Top 0.508: CR5.2 59.99,54.48 U6.3 v68.94,52.5
  Bottom 0.508: J$2.3 66.09,49.66 v68.94,52.5
HEATER6_GND
  Top 0.508: CR6.2 74.47,22.07 U7.3 72.75,23.8 72.75,13.89 74.02,12.62 J$2.1
HEATER7_GND
  Top 0.508: U8.3 26.77,18.41 CR7.2 28.75,14.45 32.61,10.59 32.61,6.27 J$3.11
HEATER8_GND
  Top 0.508: U9.3 34.39,18.41 CR8.2 36.37,14.45 40.23,10.59 40.23,6.58 J$3.9
HEATER9_GND
  Top 0.508: U10.3 42.01,18.41 CR9.2 43.99,14.96 48.36,10.59 48.36,6.38 J$3.7
HEATER10_GND
  Top 0.508: U11.3 49.63,18.41 CR10.2 52.68,15.37 52.68,14.15 56.45,10.38 56.45,8.87 56.49,8.83 56.49,8.05 58.17,6.38 J$3.5
HEATER11_GND
  Top 0.508: U12.3 57.25,18.41 CR11.2 59.23,15.47 64.11,10.59 64.11,6.48 J$3.3
HEATER12_GND
  Top 0.508: U13.3 64.87,18.41 CR12.2 66.85,11.66 67.78,10.73 | 67.78,10.73 67.92,10.59 | J$3.1 73.76,4.5 71.22,7.04 70.17,7.04 68.34,8.87 68.34,8.9 68.17,9.07 68.17,10.34 67.78,10.73
N$1  (via drill 0.3)
  Top 0.127: R5.2 v24.49,54.53 | v25.25,40.31 25.25,39.24 U3.1
  Bottom 0.127: v24.49,54.53 24.49,41.07 v25.25,40.31
N$2  (via drill 0.3)
  Top 0.127: R6.2 v21.95,53.26 | v22.2,44.88 46.84,44.88 47.85,45.9 50.67,45.9 U4.1
  Bottom 0.127: v21.95,53.26 21.95,45.14 v22.2,44.88
N$3  (via drill 0.3)
  Top 0.127: R7.2 23.72,51.99 v22.96,51.23 | v22.96,57.33 45.82,57.33 v46.08,57.58 | v46.08,62.92 51.36,62.92 U5.1
  Bottom 0.127: v22.96,51.23 v22.96,57.33 | v46.08,57.58 v46.08,62.92
N$4  (via drill 0.3)
  Top 0.127: R8.2 24.23,50.72 v23.47,49.96 | v24.74,56.57 25.5,56.57 26.01,57.07 46.08,57.07 47.35,55.8 50.85,55.8 U6.1
  Bottom 0.127: v23.47,49.96 23.47,55.3 v24.74,56.57
N$5  (via drill 0.3)
  Top 0.127: R9.2 23.72,49.45 v22.71,48.44 | v23.22,41.58 49.12,41.58 v52.68,38.02 | v53.7,31.42 54.46,31.42 54.97,31.93 60.15,31.93 61.17,32.94 71.96,32.94 U7.1
  Bottom 0.127: v22.71,48.44 22.71,42.09 v23.22,41.58 | v52.68,38.02 52.68,32.44 v53.7,31.42
N$6  (via drill 0.3)
  Top 0.127: R10.2 24.49,48.18 v23.47,47.17 | v24.74,31.93 27.26,31.93 U8.1
  Bottom 0.127: v23.47,47.17 23.47,41.95 23.71,41.71 23.71,32.95 v24.74,31.93
N$7  (via drill 0.3)
  Top 0.127: R11.2 26,45.66 26.52,45.14 34.65,45.14 v35.41,45.9 | v35.41,31.17 35.64,31.17 U9.1
  Bottom 0.127: v35.41,45.9 v35.41,31.17
N$8  (via drill 0.3)
  Top 0.127: R12.2 46.6,47.69 45.82,46.91 44.55,46.91 v44.3,46.66 | v45.82,30.4 44.5,30.4 U10.1
  Bottom 0.127: v44.3,46.66 44.3,31.93 v45.82,30.4
N$9  (via drill 0.3)
  Top 0.127: R13.2 46.84,49.45 v48.36,47.93 | v48.62,31.42 50.62,31.42 U11.1
  Bottom 0.127: v48.36,47.93 48.36,47.42 46.08,45.14 46.08,35.48 47.6,33.96 47.6,32.44 v48.62,31.42
N$10  (via drill 0.3)
  Top 0.127: R14.2 47.09,50.72 49.63,48.18 53.86,48.18 54.07,48.4 62.8,48.4 v63.09,48.69 | v60.81,30.91 60.25,30.91 U12.1
  Bottom 0.127: v63.09,48.69 63.09,39.29 62.08,38.28 62.08,32.18 v60.81,30.91
N$11  (via drill 0.3)
  Top 0.127: R15.2 51.34,51.99 v51.6,52.25 | v55.22,40.31 v69.95,40.31 | v68.68,31.42 68.38,31.42 U13.1
  Bottom 0.127: v51.6,52.25 51.6,43.93 v55.22,40.31 | v69.95,40.31 69.95,32.69 v68.68,31.42
N$12
  pour Top (isolate 0.254): 0.1,-0.08 91.54,-0.08 91.54,72.31 81.38,72.31 81.38,82.47 8.99,82.47 8.99,72.31 0.1,72.31
N$13
  pour Bottom (isolate 0.254): 0.1,-0.08 91.54,-0.08 91.54,72.31 81.38,72.31 81.38,81.2 10.26,81.2 10.26,72.31 0.1,72.31
N$18  (via drill 0.3)
  Top 0.127: R4.2 21.44,55.8 v21.18,55.55 | v22.96,31.42 22.66,31.42 U2.1
  Bottom 0.127: v21.18,55.55 21.18,33.2 v22.96,31.42
N$20  (via drill 0.3)
  Top 0.127: R24.1 v16.36,72.06 | v15.6,62.41 12.65,62.41 J$5.12
  Bottom 0.127: v16.36,72.06 16.36,71.81 15.85,71.3 15.85,62.66 v15.6,62.41
N$21  (via drill 0.3)
  Top 0.127: R25.1 17.12,70.79 v16.87,71.04 | v16.1,49.45 11.58,49.45 J$5.9
  Bottom 0.127: v16.87,71.04 16.61,71.04 16.1,70.54 v16.1,49.45
N$22  (via drill 0.3)
  Top 0.127: R26.1 v17.37,69.52 | v17.37,37.77 11.79,37.77 J$5.6
  Bottom 0.127: v17.37,69.52 17.12,69.52 16.36,68.76 16.36,50.47 17.37,49.45 v17.37,37.77
N$23  (via drill 0.3)
  Top 0.127: R27.1 v17.88,68.25 | v15.45,25.58 11.58,25.58 J$5.3
  Bottom 0.127: v17.88,68.25 17.37,68.25 16.61,67.49 16.61,50.57 17.82,49.37 17.82,27.95 v15.45,25.58
N$24  (via drill 0.3)
  Top 0.127: R28.1 v18.39,66.98 | v17.63,60.38 13.56,60.38 12.8,59.61 6.86,59.61 J$6.12
  Bottom 0.127: v18.39,66.98 17.63,66.98 16.87,66.22 16.87,61.14 v17.63,60.38
N$25  (via drill 0.3)
  Top 0.127: R29.1 v18.9,65.71 | v18.64,51.49 7.26,51.49 J$6.9
  Bottom 0.127: v18.9,65.71 18.14,65.71 17.37,64.95 17.37,61.9 18.64,60.63 v18.64,51.49
N$26  (via drill 0.3)
  Top 0.127: R30.1 v19.41,64.44 | v19.41,39.8 7.47,39.8 J$6.6
  Bottom 0.127: v19.41,64.44 v19.41,39.8
N$27  (via drill 0.3)
  Top 0.127: R31.1 v20.17,63.17 | v14.83,23.29 7.52,23.29 J$6.3
  Bottom 0.127: v20.17,63.17 20.17,28.63 v14.83,23.29
N$28  (via drill 0.3)
  Top 0.127: R32.1 48.11,60.63 v48.62,60.12 | v51.92,32.18 60.05,32.18 61.06,33.2 81.86,33.2 81.92,33.15 83.97,33.15 v85.45,31.67
  Bottom 0.127: v48.62,60.12 49.38,60.12 50.9,58.6 50.9,33.2 v51.92,32.18 | v85.45,31.67 85.45,21.62 J$7.12
N$29  (via drill 0.3)
  Top 0.127: R33.1 49.38,61.9 v51.16,60.12 | v52.17,33.45 81.97,33.45 82.02,33.4 85.55,33.4 J$7.9
  Bottom 0.127: v51.16,60.12 51.16,34.47 v52.17,33.45
N$30  (via drill 0.3)
  Top 0.127: R34.1 41.82,63.17 45.78,67.13 55.32,67.13 v56.24,66.22 | v60.81,39.55 79.86,39.55 80.87,40.56 85.7,40.56 J$7.6
  Bottom 0.127: v60.81,39.55 59.02,41.33 59.02,66.78 58.58,67.22 57.96,67.22 56.95,66.22 v56.24,66.22
N$31  (via drill 0.3)
  Top 0.127: R35.1 42.73,64.44 45.67,67.38 64.98,67.38 v66.9,65.46 | v68.43,56.06 80.87,56.06 81.38,56.57 86.16,56.57 J$7.3
  Bottom 0.127: v66.9,65.46 66.9,57.58 v68.43,56.06
N$32  (via drill 0.3)
  Top 0.127: R36.1 43.64,65.71 45.67,67.74 67.41,67.74 v68.68,66.47 | v76.56,18.47 82.04,18.47 J$8.12
  Bottom 0.127: v68.68,66.47 70.21,66.47 76.56,60.12 v76.56,18.47
N$33  (via drill 0.3)
  Top 0.127: R37.1 44.55,66.98 45.57,68 70.97,68 v71.98,66.98 | v77.06,30.91 82.6,30.91 J$8.9
  Bottom 0.127: v71.98,66.98 71.98,65.2 76.81,60.38 76.81,31.17 v77.06,30.91
N$34  (via drill 0.3)
  Top 0.127: R38.1 73,68.25 v74.02,67.23 | v77.83,43.1 82.4,43.1 J$8.6
  Bottom 0.127: v74.02,67.23 74.02,64.69 77.83,60.88 v77.83,43.1
N$35  (via drill 0.3)
  Top 0.127: R39.1 50.52,69.52 51.52,68.51 v75.53,68.51 v75.54,68.5 | v78.59,54.79 82.6,54.79 J$8.3
  Bottom 0.127: v75.54,68.5 75.54,65.46 78.59,62.41 v78.59,54.79
OE  (via drill 0.3)
  Top 0.127: R23.1 R3.1 v41.76,70.79 | U21.23 36.72,69.22 v36.93,69.01 | U1.23 41.8,52.97 v42.27,52.5
  Bottom 0.127: v36.93,69.01 39.98,69.01 v41.76,70.79 42.27,70.28 v42.27,52.5
PWM0
  Top 0.127: U1.6 30.38,52.97 R4.1
PWM0L
  Top 0.127: R24.2 26.06,69.22 U21.6
PWM1
  Top 0.127: U1.7 29.76,52.32 R5.1
PWM1L
  Top 0.127: R25.2 25.44,68.57 U21.7
PWM2
  Top 0.127: U1.8 29.14,51.67 R6.1
PWM2L
  Top 0.127: R26.2 24.82,67.92 U21.8
PWM3
  Top 0.127: U1.9 28.52,51.02 R7.1
PWM3L
  Top 0.127: R27.2 24.2,67.27 U21.9
PWM4
  Top 0.127: U1.10 27.9,50.37 R8.1
PWM4L
  Top 0.127: R28.2 23.58,66.62 U21.10
PWM5
  Top 0.127: U1.11 27.81,49.72 R9.1
PWM5L
  Top 0.127: R29.2 23.49,65.97 U21.11
PWM6
  Top 0.127: U1.12 31.47,49.07 30.58,48.18 R10.1
PWM6L
  Top 0.127: R30.2 24.11,65.32 U21.12
PWM7
  Top 0.127: U1.13 31.83,48.42 30.58,47.17 27.8,47.17 R11.1
PWM7L
  Top 0.127: R31.2 24.73,64.67 U21.13
PWM8
  Top 0.127: U1.15 44.63,47.77 R12.1
PWM8L
  Top 0.127: U21.15 35.05,64.02 R32.2
PWM9
  Top 0.127: U1.16 44.01,48.42 R13.1
PWM9L
  Top 0.127: U21.16 35.67,64.67 R33.2
PWM10
  Top 0.127: U1.17 43.39,49.07 R14.1
PWM10L
  Top 0.127: U21.17 36.29,65.32 R34.2
PWM11
  Top 0.127: U1.18 42.77,49.72 R15.1
PWM11L
  Top 0.127: U21.18 36.91,65.97 R35.2
PWM12L
  Top 0.127: U21.19 37.53,66.62 R36.2
PWM13L
  Top 0.127: U21.20 38.15,67.27 R37.2
PWM14L
  Top 0.127: U21.21 38.12,67.92 R38.2
PWM15L
  Top 0.127: R39.2 38.06,69.52 37.11,68.57 34.88,68.57 U21.22
SCL  (via drill 0.3)
  Top 0.127: U21.26 36.3,71.17 37.44,72.31 37.44,72.33 R1.2 42.93,77.81 J$1.7 41.34,80.25 32.94,80.25 31.99,81.2 v31.6,81.2 | U1.26 38.59,54.92 38.2,54.53 36.17,54.53 v35.92,54.79
  Bottom 0.127: v35.92,54.79 35.92,58.75 33.38,61.29 33.38,76.78 32.87,77.29 32.87,79.93 v31.6,81.2
SDA  (via drill 0.3)
  Top 0.127: U21.27 35.69,71.82 R2.2 38.46,74.59 v38.46,74.85 | v42.52,76.12 43.03,76.63 45.31,76.63 46.89,78.21 J$1.8 44.86,80.7 v33.12,80.7 | U1.27 38.22,55.57 v37.69,55.04
  Bottom 0.127: v42.52,76.12 39.73,76.12 v38.46,74.85 | v37.69,55.04 37.69,57.33 33.63,61.39 33.63,76.89 33.12,77.39 v33.12,80.7
TEMP  (via drill 0.3)
  Top 0.127: J$1.4 31.04,78.21 32.61,76.63 39.73,76.63 v39.98,76.89 | v48.62,75.62 62.33,75.62 v62.84,76.12 | v63.35,64.69 67.41,64.69 68.64,65.92 U14.1 | v62.59,44.63 75.29,44.63 v78.84,41.07 | v76.81,16.43 78.91,16.43 U17.1 | v77.06,2.72 v21.95,2.72 | v22.2,8.56 20.07,8.56 U16.1 | U15.1 59.35,37.47 60.14,38.27 63.59,38.27 64.36,39.04 77.06,39.04 v77.83,38.28
  Bottom 0.127: v39.98,76.89 47.35,76.89 v48.62,75.62 | v62.84,76.12 62.84,65.2 v63.35,64.69 63.35,50.47 62.08,49.2 62.08,45.14 v62.59,44.63 | 78.84,40.98 v78.84,41.07 | 78.84,40.98 78.84,18.47 v76.81,16.43 76.81,15.16 75.79,14.15 75.79,3.99 v77.06,2.72 | v21.95,2.72 21.95,8.31 v22.2,8.56 | v77.83,38.28 77.83,39.97 78.84,40.98
VCC  (via drill 0.5, 0.6, 0.75)
  Top 0.305: R2.1 35.17,74.1 34.65,73.58 34.65,72.86 U21.28 U21.1 U21.2 | 40.02,56.22 U1.28 | 40.02,56.22 44.39,56.22 v44.55,56.06 | U1.1 40.02,56.22
  Top 0.406: R1.1 v45.06,73.33 | 35.17,74.1 35.17,75.35 v35.15,75.36
  Top 0.508: C2.2 v71.48,79.43 | C3.2 71.98,76.89 v71.73,77.14 | U14.8 76.59,65.92 v76.63,65.96 | U16.8 27.75,8.52 v27.79,8.56 | U17.8 86.76,16.39 v86.97,16.18 | U15.8 63.31,37.47 v63.35,37.52
  Route2 0.406: v45.06,73.33 49.48,73.33 J$1.10 54.81,78.77 56.49,80.44 70.46,80.44 v71.48,79.43 71.48,77.39 v71.73,77.14 71.73,70.86 76.59,66 | 76.59,66 v76.63,65.96 | v45.06,73.33 44.55,72.82 v44.55,56.06 44.55,55.02 45,54.57 45,41.64 49.12,37.52 52.36,37.52 52.44,37.44 52.92,37.44 52.99,37.52 v63.35,37.52 | 86.97,16.38 v86.97,16.18 | 86.97,16.38 86.97,17.74 86.32,18.39 86.32,62.04 83.41,64.95 77.64,64.95 76.59,66 | v27.79,8.56 27.79,3.99 29.82,1.96 84.43,1.96 87.22,4.75 87.22,16.13 86.97,16.38 | v35.15,75.36 38.14,75.36 38.21,75.44 42.95,75.44 v45.06,73.33
  Route2 0.508: v76.63,65.96 76.81,65.96
VIN
  Top 0.508: Q1.3 70.21,72.31 65.89,76.63 64.77,76.63 J$1.12